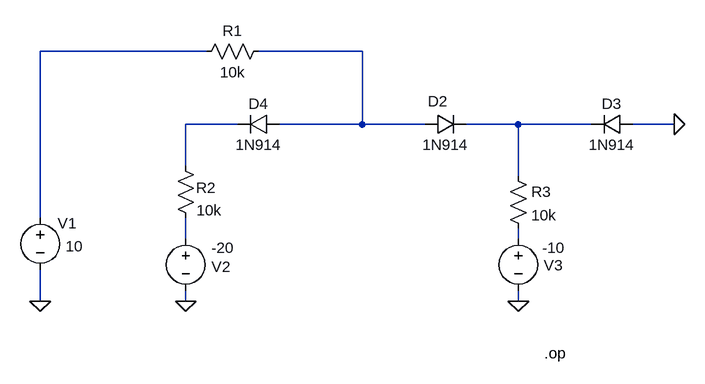
[diagram p0: schematic DidesCircuitEx1.asc]
DidesCircuitEx1.asc, the LTspice schematic file:
Version 4
SHEET 1 880 680
WIRE -112 112 -368 112
WIRE 128 112 -32 112
WIRE -64 224 -144 224
WIRE 128 224 128 112
WIRE 128 224 0 224
WIRE 224 224 128 224
WIRE 368 224 288 224
WIRE 480 224 368 224
WIRE 608 224 544 224
WIRE -144 288 -144 224
WIRE 368 304 368 224
WIRE -368 368 -368 112
WIRE -144 400 -144 368
WIRE 368 400 368 384
WIRE -368 496 -368 448
WIRE -144 496 -144 480
WIRE 368 496 368 480
FLAG -368 496 0
FLAG -144 496 0
FLAG 368 496 0
FLAG 608 224 0
DATAFLAG 128 224 ""
DATAFLAG -144 224 ""
DATAFLAG 384 224 ""
SYMBOL voltage -368 352 R0
WINDOW 123 0 0 Left 2
WINDOW 39 0 0 Left 2
WINDOW 3 39 60 Left 2
WINDOW 0 27 24 Left 2
SYMATTR Value 10
SYMATTR InstName V1
SYMBOL voltage -144 384 R0
WINDOW 123 0 0 Left 2
WINDOW 39 0 0 Left 2
WINDOW 3 40 30 Left 2
WINDOW 0 40 59 Left 2
SYMATTR Value -20
SYMATTR InstName V2
SYMBOL res -128 128 R270
WINDOW 0 32 56 VTop 2
WINDOW 3 0 56 VBottom 2
SYMATTR InstName R1
SYMATTR Value 10k
SYMBOL res -160 272 R0
WINDOW 0 32 50 Left 2
WINDOW 3 33 84 Left 2
SYMATTR InstName R2
SYMATTR Value 10k
SYMBOL res 352 288 R0
SYMATTR InstName R3
SYMATTR Value 10k
SYMBOL diode 224 240 R270
WINDOW 0 36 20 VTop 2
WINDOW 3 0 32 VBottom 2
SYMATTR InstName D2
SYMATTR Value 1N914
SYMBOL diode 544 208 R90
WINDOW 0 0 32 VBottom 2
WINDOW 3 32 32 VTop 2
SYMATTR InstName D3
SYMATTR Value 1N914
SYMBOL diode 0 208 R90
WINDOW 0 0 32 VBottom 2
WINDOW 3 32 32 VTop 2
SYMATTR InstName D4
SYMATTR Value 1N914
SYMBOL voltage 368 384 R0
WINDOW 123 0 0 Left 2
WINDOW 39 0 0 Left 2
WINDOW 3 37 30 Left 2
WINDOW 0 39 57 Left 2
SYMATTR Value -10
SYMATTR InstName V3
TEXT 408 576 Left 2 !.op

The netlist it stands for:
* DidesCircuitEx1.asc
V1 N001 0 10
V2 N005 0 -20
R1 N001 N002 10k
R2 N003 N005 10k
R3 N004 N006 10k
D2 N002 N004 1N914
D3 0 N004 1N914
D4 N002 N003 1N914
V3 N006 0 -10
.model D D
.lib standard.dio
.op
.backanno
.end